# Altium schematic sheet NBIOT.SchDoc
size A3
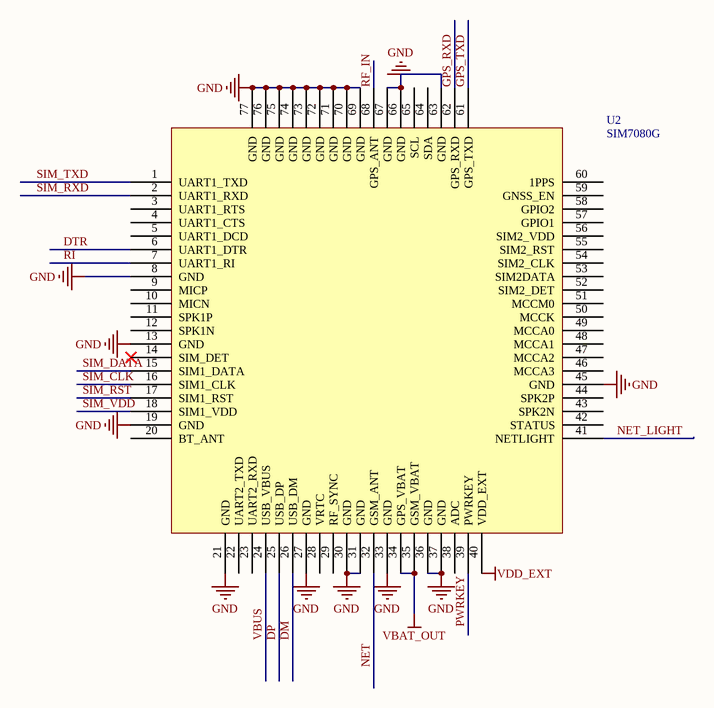
[diagram p0: NBIOT.SchDoc]

## Parts
U2  SIM7080G  [SIM868]

## Nets
GND: U2.8(GND) U2.13(GND) U2.19(GND) U2.21(GND) U2.27(GND) U2.30(GND) U2.31(GND) U2.33(GND) U2.36(GND) U2.37(GND) U2.45(GND) U2.63(GND) U2.66(GND) U2.67(GND) U2.69(GND) U2.70(GND) U2.71(GND) U2.72(GND) U2.73(GND) U2.74(GND) U2.75(GND) U2.76(GND) U2.77(GND)
VBAT_OUT: U2.34(GPS_VBAT) U2.35(GSM_VBAT)
VDD_EXT: U2.40(VDD_EXT)
DM: U2.26(USB_DM)
DP: U2.25(USB_DP)
DTR: U2.6(UART1_DTR)
GPS_RXD: U2.62(GPS_RXD)
GPS_TXD: U2.61(GPS_TXD)
NET: U2.32(GSM_ANT)
NET_LIGHT: U2.41(NETLIGHT)
PWRKEY: U2.39(PWRKEY)
RF_IN: U2.68(GPS_ANT)
RI: U2.7(UART1_RI)
SIM_CLK: U2.16(SIM1_CLK)
SIM_DATA: U2.15(SIM1_DATA)
SIM_RST: U2.17(SIM1_RST)
SIM_RXD: U2.2(UART1_RXD)
SIM_TXD: U2.1(UART1_TXD)
SIM_VDD: U2.18(SIM1_VDD)
VBUS: U2.24(USB_VBUS)

Not connected (* = marked no-connect by the designer): U2 3(UART1_RTS) 4(UART1_CTS) 5(UART1_DCD) 9(MICP) 10(MICN) 11(SPK1P) 12(SPK1N) 14(SIM_DET)* 20(BT_ANT) 22(UART2_TXD) 23(UART2_RXD) 28(VRTC) 29(RF_SYNC) 38(ADC) 42(STATUS) 43(SPK2N) 44(SPK2P) 46(MCCA3) 47(MCCA2) 48(MCCA1) 49(MCCA0) 50(MCCK) 51(MCCM0) 52(SIM2_DET) 53(SIM2DATA) 54(SIM2_CLK) 55(SIM2_RST) 56(SIM2_VDD) 57(GPIO1) 58(GPIO2) 59(GNSS_EN) 60(1PPS) 64(SDA) 65(SCL)

## Library data of the parts
U2 = SIM868E/SIM868